# EasyEDA schematic 1-Schematic_54M-1_v1.0.2.json

## Sheets
1 Main: TITLE: Spectrum clone 54M-1; REV: 1.0.2; Date: 2022-12-22; Sheet: 1/2; Drawn By: Romych; Company: ZX-PK.RU
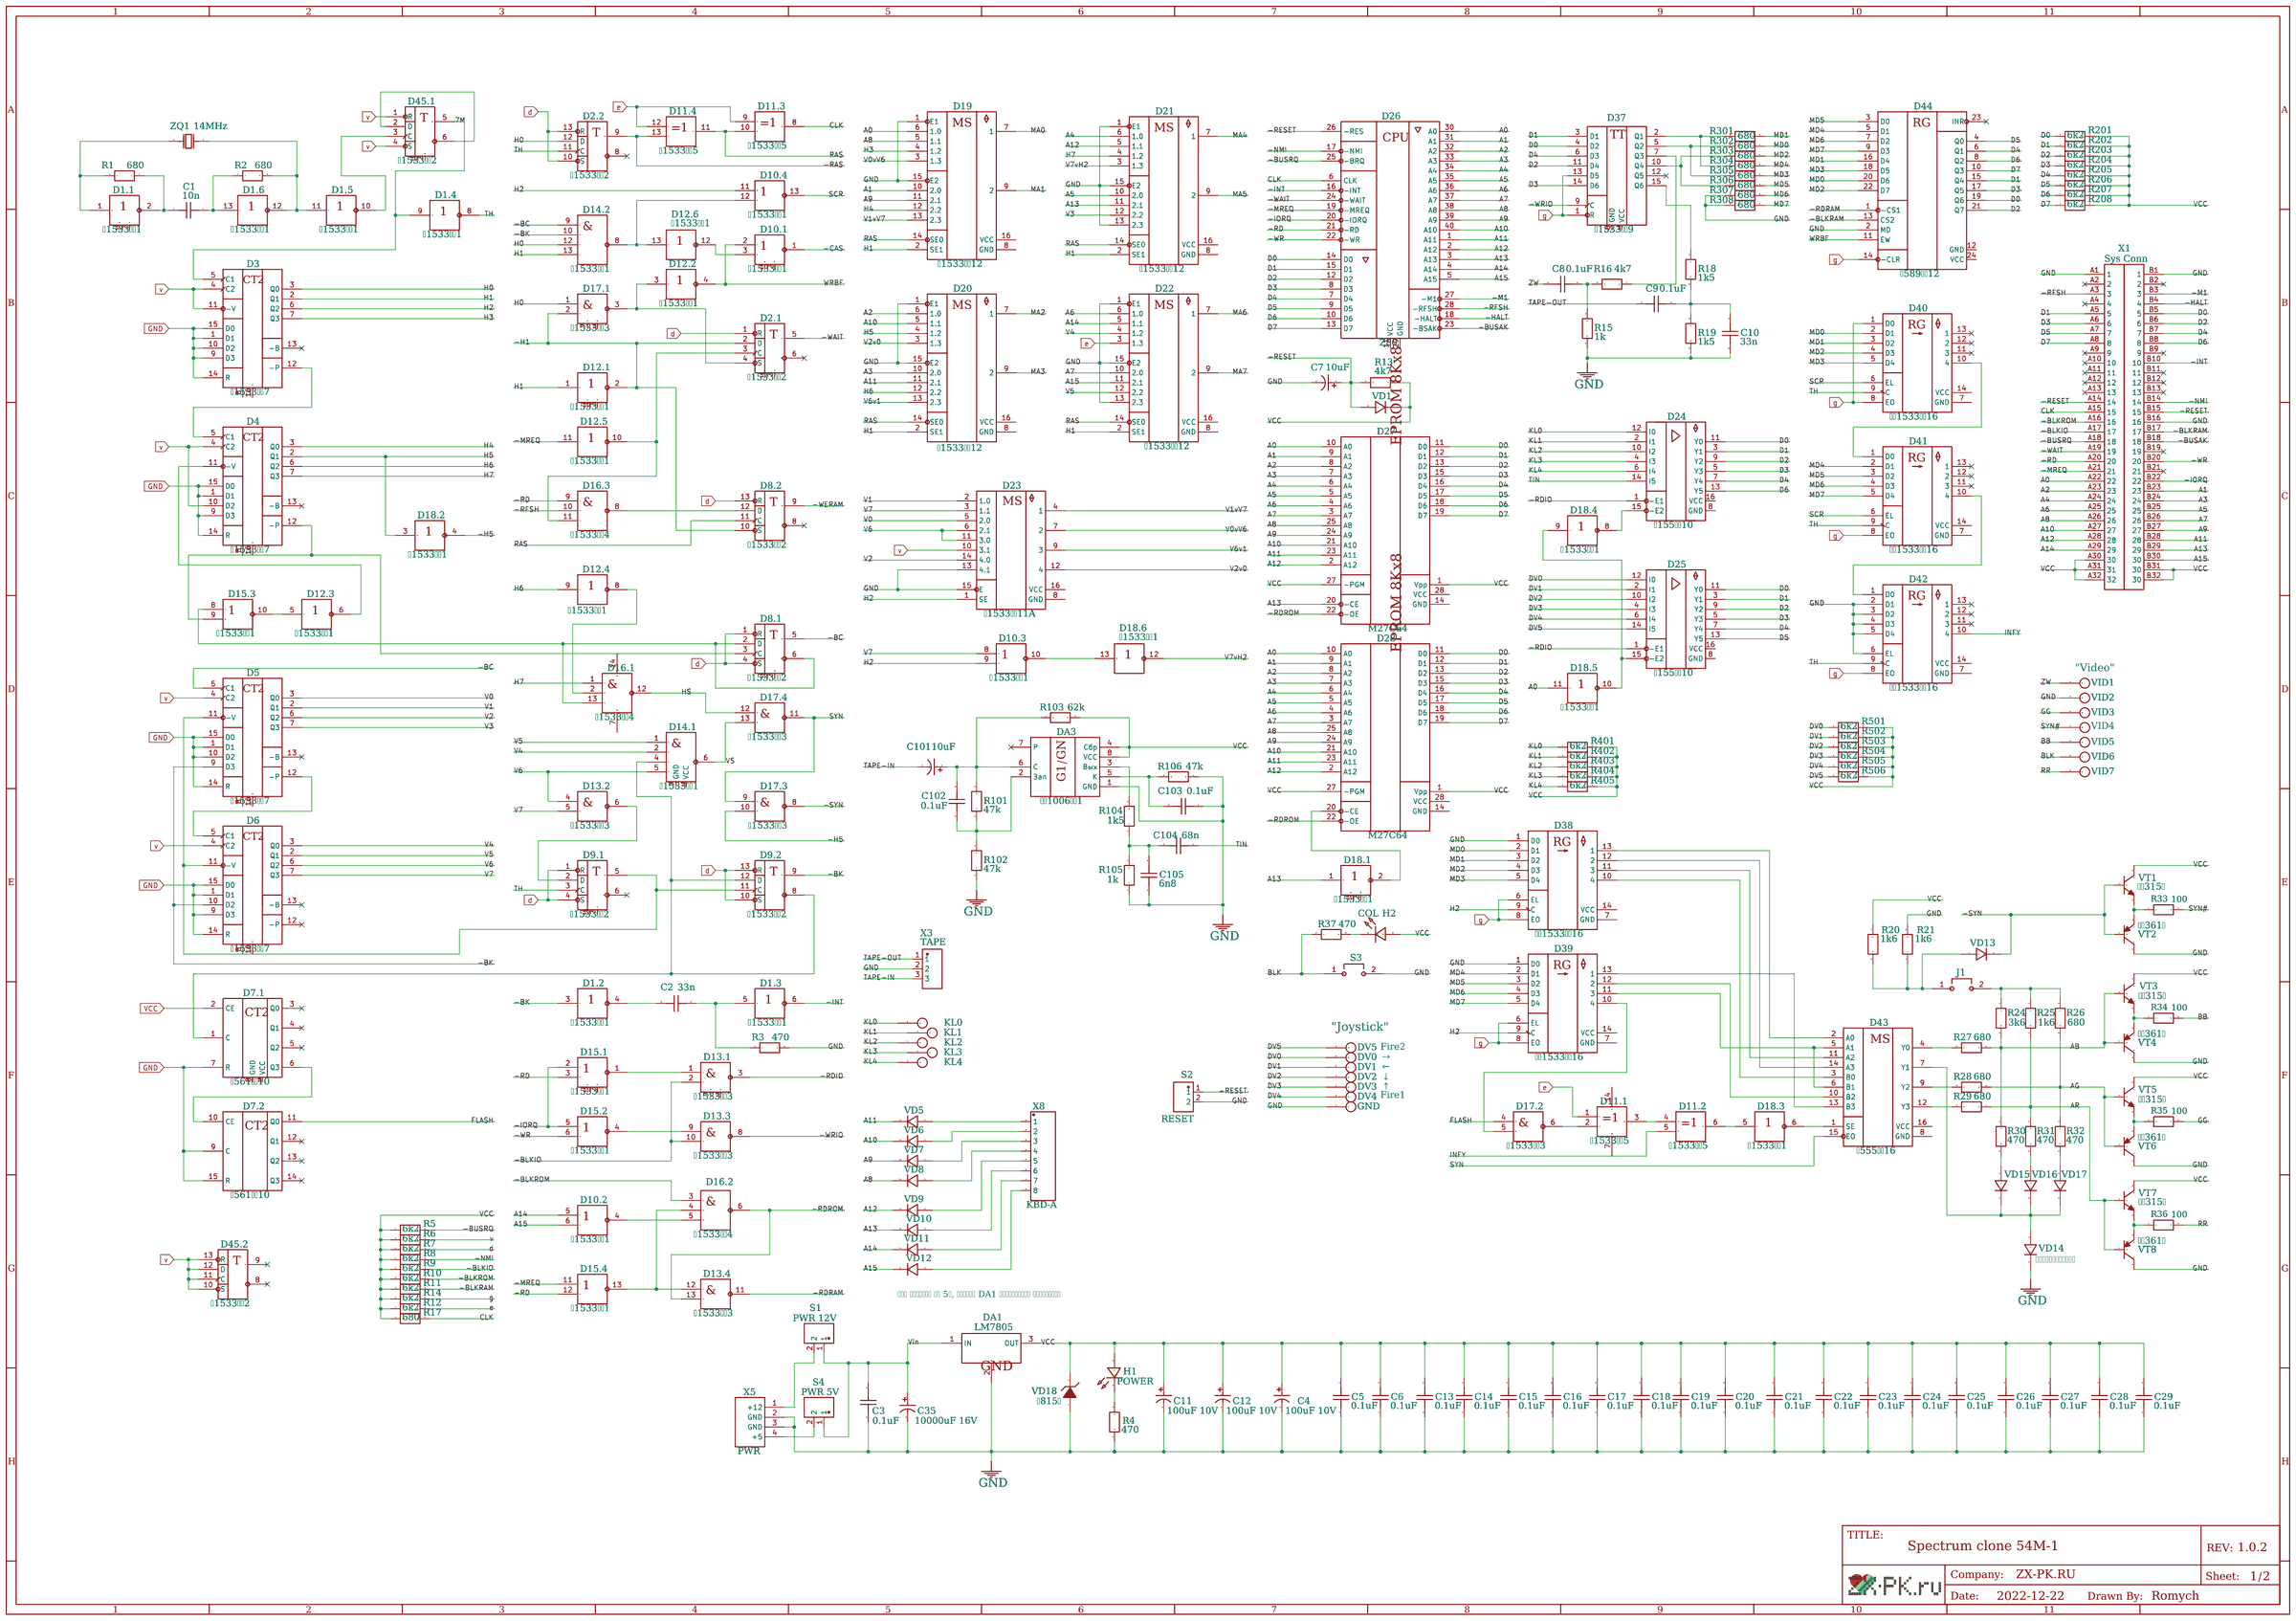
[diagram p0: Main]
2 DRAM: TITLE: Spectrum clone 54M-1 (DRAM); Sheet: 2/2
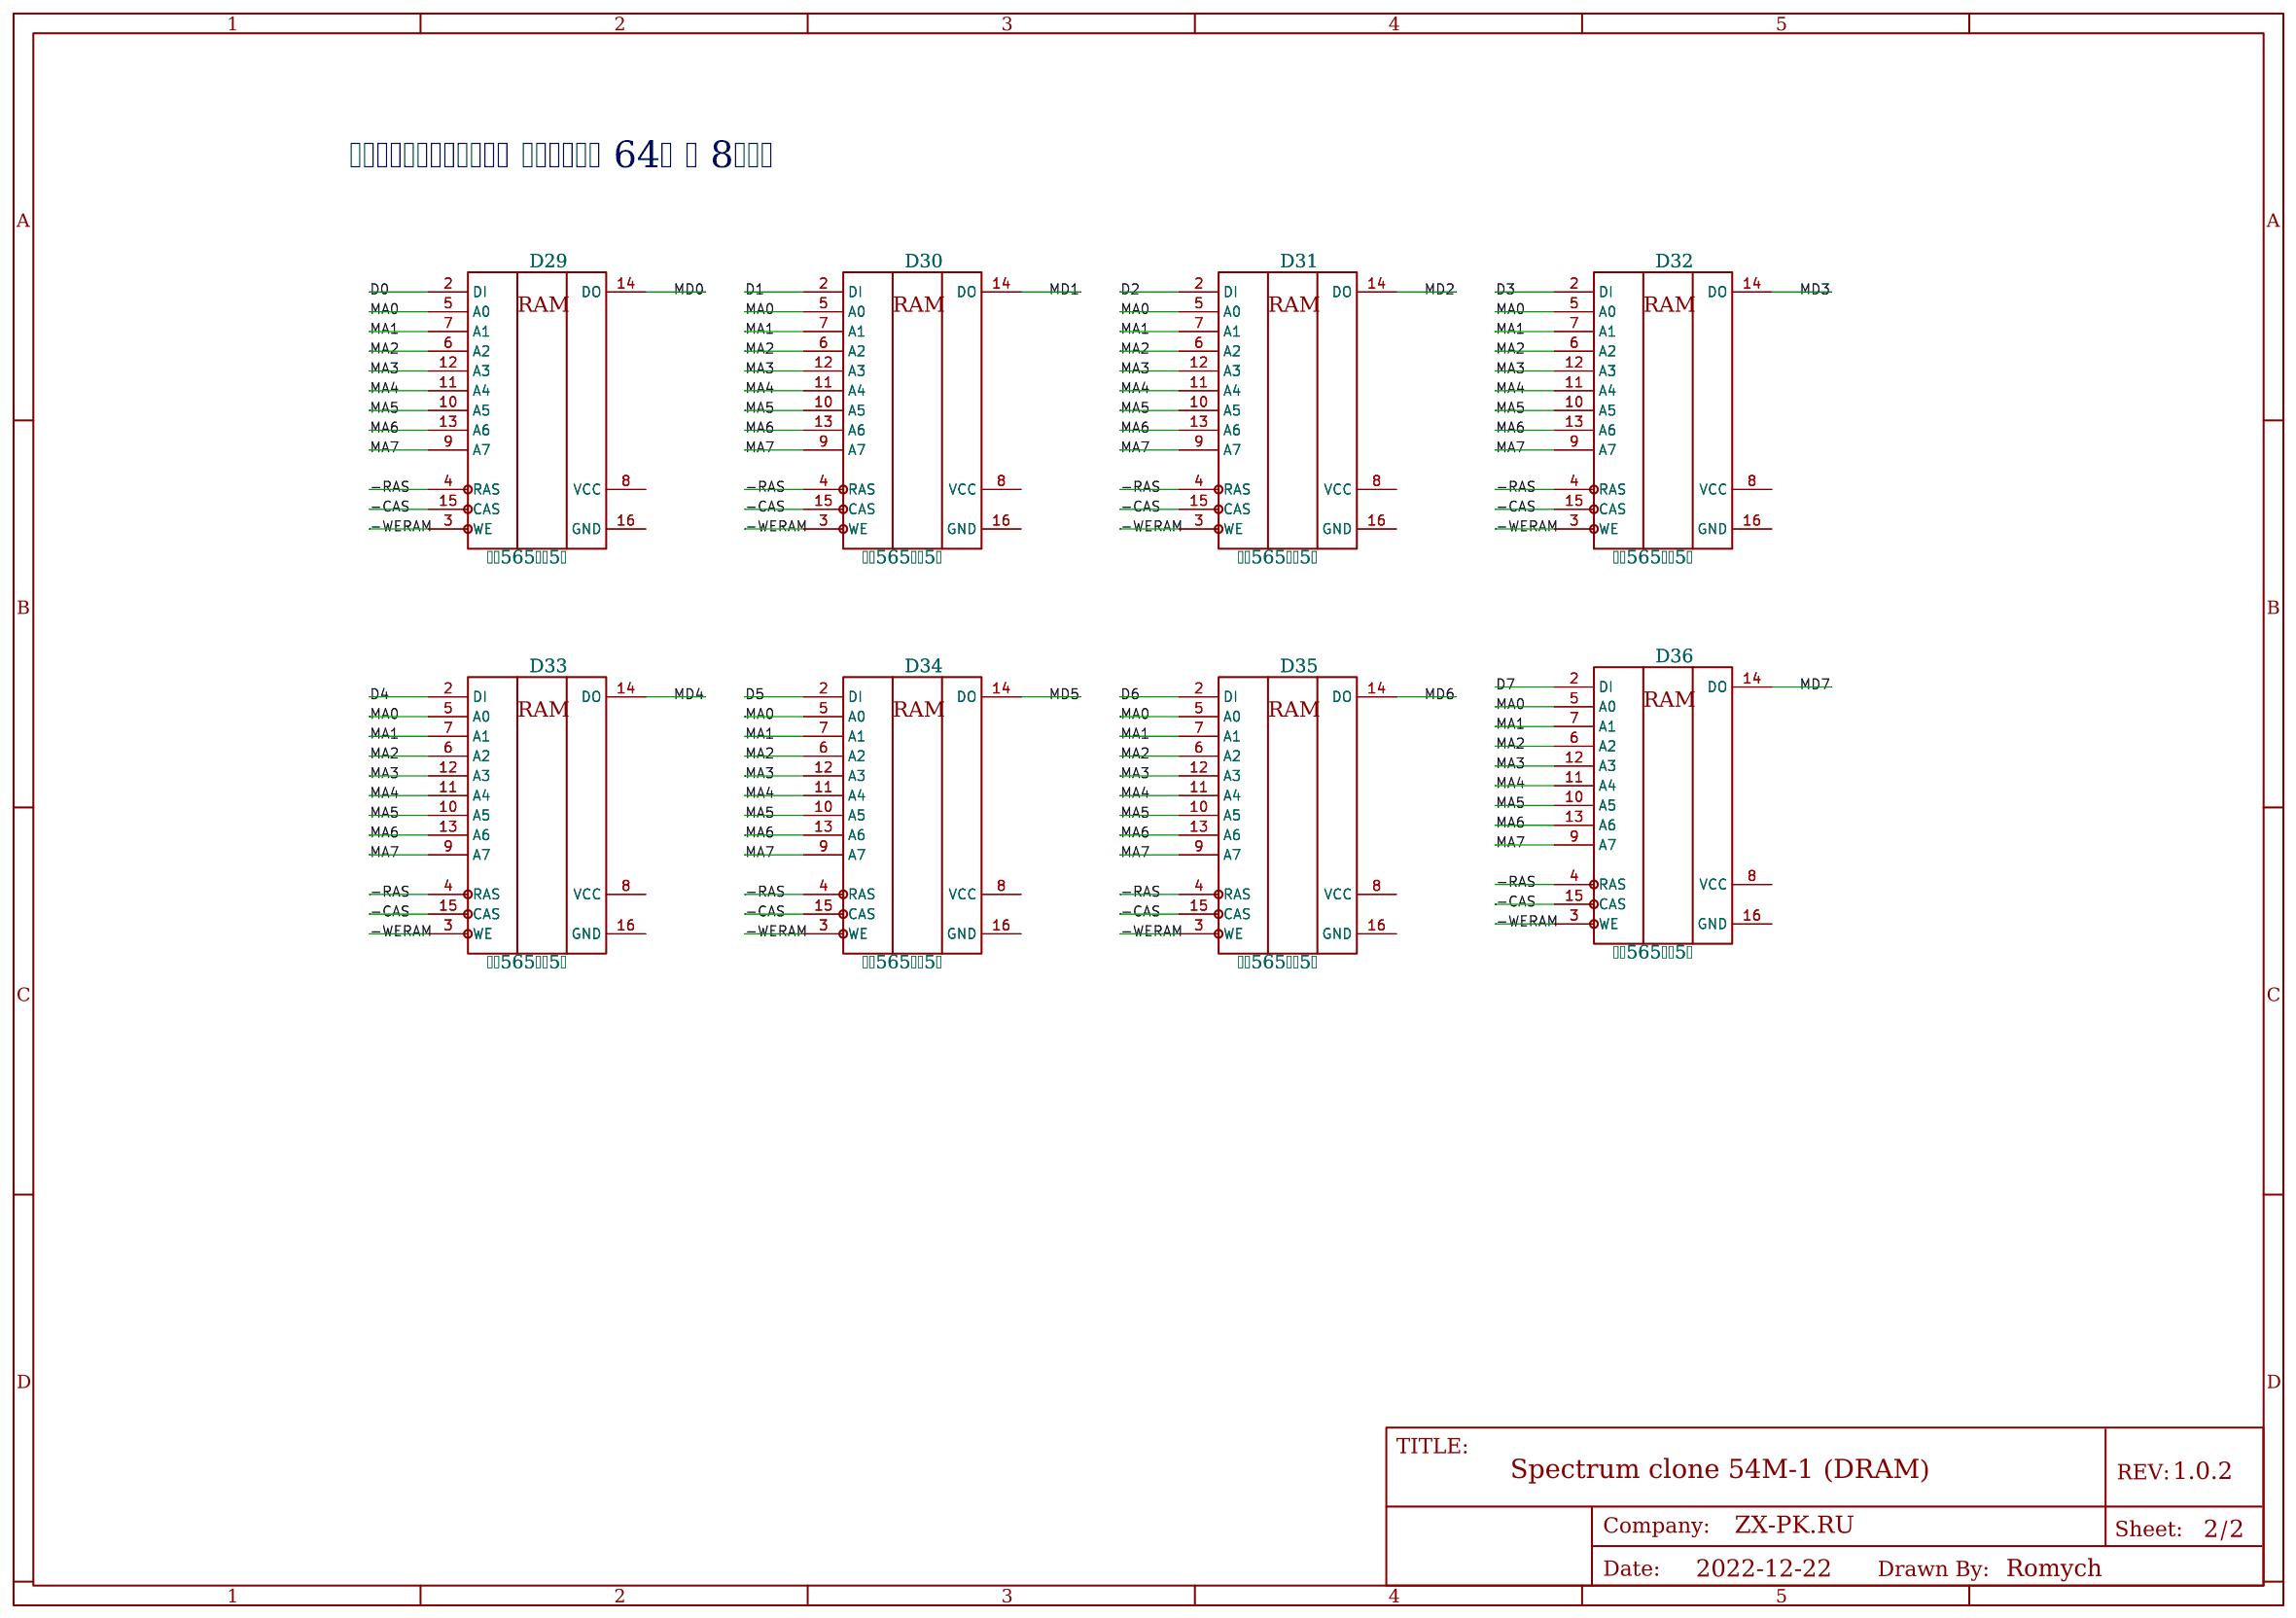
[diagram p1: DRAM]

## Parts
sheet DRAM
D29  КР565РУ5Г  [DIP-16_STD]
D30  КР565РУ5Г  [DIP-16_STD]
D31  КР565РУ5Г  [DIP-16_STD]
D32  КР565РУ5Г  [DIP-16_STD]
D33  КР565РУ5Г  [DIP-16_STD]
D34  КР565РУ5Г  [DIP-16_STD]
D35  КР565РУ5Г  [DIP-16_STD]
D36  КР565РУ5Г  [DIP-16_STD]
sheet Main
C1  10n  [CAP-TH_L5.08]
C2  33n  [CAP-TH_L5.08]
C3  0.1uF  [CAP-TH_L7.62]
C4  100uF 10V  [CAP-TH_L25_P7.62_EL_V]
C5  0.1uF  [CAP-TH_L7.62]
C6  0.1uF  [CAP-TH_L7.62]
C7  10uF  [CAP-TH_BD6.3-P2.50-D1.0-FD]
C8  0.1uF  [CAP-TH_L7.0-W3.0-P5.00-D0.9]
C9  0.1uF  [CAP-TH_L7.0-W3.0-P5.00-D0.9]
C10  33n  [CAP-TH_L7.0-W3.0-P5.00-D0.9]
C11  100uF 10V  [CAP-TH_L25_P7.62_EL_V]
C12  100uF 10V  [CAP-TH_L25_P7.62_EL_V]
C13  0.1uF  [CAP-TH_L7.62]
C14  0.1uF  [CAP-TH_L7.62]
C15  0.1uF  [CAP-TH_L7.62]
C16  0.1uF  [CAP-TH_L7.62]
C17  0.1uF  [CAP-TH_L7.62]
C18  0.1uF  [CAP-TH_L7.62]
C19  0.1uF  [CAP-TH_L7.62]
C20  0.1uF  [CAP-TH_L7.62]
C21  0.1uF  [CAP-TH_L7.62]
C22  0.1uF  [CAP-TH_L7.62]
C23  0.1uF  [CAP-TH_L7.62]
C24  0.1uF  [CAP-TH_L7.62]
C25  0.1uF  [CAP-TH_L7.62]
C26  0.1uF  [CAP-TH_L7.62]
C27  0.1uF  [CAP-TH_L7.62]
C28  0.1uF  [CAP-TH_L7.62]
C29  0.1uF  [CAP-TH_L7.62]
C35  10000uF 16V  [CAP-TH_L25_P7.62_EL_V]
C101  10uF  [CAP-TH_BD6.3-P2.50-D1.0-FD]
C102  0.1uF  [CAP-TH_L7.0-W3.0-P5.00-D0.9]
C103  0.1uF  [CAP-TH_L7.0-W3.0-P5.00-D0.9]
C104  68n  [CAP-TH_L7.0-W3.0-P5.00-D0.9]
C105  6n8  [CAP-TH_L7.0-W3.0-P5.00-D0.9]
D1  К1533ЛН1  [DIP-14_STD]  (sections 1,2,3,4,5,6)
D2  К1533ТМ2  [DIP-14_STD]  (sections 1,2)
D3  К1533ИЕ7  [DIP-16_STD]
D4  К1533ИЕ7  [DIP-16_STD]
D5  К1533ИЕ7  [DIP-16_STD]
D6  К1533ИЕ7  [DIP-16_STD]
D7  К561ИЕ10  [DIP-16_STD]  (sections 1,2)
D8  К1533ТМ2  [DIP-14_STD]  (sections 1,2)
D9  К1533ТМ2  [DIP-14_STD]  (sections 1,2)
D10  К1533ЛЕ1  [DIP-14_STD]  (sections 1,2,3,4)
D11  К1533ЛП5  [DIP-14_STD]  (sections 1,2,3,4)
D12  К1533ЛН1  [DIP-14_STD]  (sections 1,2,3,4,5,6)
D13  К1533ЛА3  [DIP-14_STD]  (sections 1,2,3,4)
D14  К1533ЛА1  [DIP-14_STD]  (sections 1,2)
D15  К1533ЛЕ1  [DIP-14_STD]  (sections 1,2,3,4)
D16  К1533ЛА4  [DIP-14_STD]  (sections 1,2,3)
D17  К1533ЛА3  [DIP-14_STD]  (sections 1,2,3,4)
D18  К1533ЛН1  [DIP-14_STD]  (sections 1,2,3,4,5,6)
D19  К1533КП12  [DIP-16_STD]
D20  К1533КП12  [DIP-16_STD]
D21  К1533КП12  [DIP-16_STD]
D22  К1533КП12  [DIP-16_STD]
D23  К1533КП11A  [DIP-16_STD]
D24  К155ЛП10  [DIP-16_STD]
D25  К155ЛП10  [DIP-16_STD]
D26  Z80  [DIP-40_STD]
D27  M27C64  [DIP-28_STD]
D28  M27C64  [DIP-28_STD]
D37  К1533ТМ9  [DIP-16_STD]
D38  КР1533ИР16  [DIP-14_STD]
D39  КР1533ИР16  [DIP-14_STD]
D40  КР1533ИР16  [DIP-14_STD]
D41  КР1533ИР16  [DIP-14_STD]
D42  КР1533ИР16  [DIP-14_STD]
D43  К555КП16  [DIP-16_STD]
D44  К589ИР12  [DIP-24_STD]
D45  К1533ТМ2  [DIP-14_STD]  (sections 1,2)
DA1  LM7805  [TO-220-3_L10.2-W4.5-P2.54-L]
DA3  КР1006ВИ1  [DIP-8_STD]
DV0  TH-TEST-1  [TH-TEST-1]
DV1  TH-TEST-1  [TH-TEST-1]
DV2  TH-TEST-1  [TH-TEST-1]
DV3  TH-TEST-1  [TH-TEST-1]
DV4  TH-TEST-1  [TH-TEST-1]
DV5  TH-TEST-1  [TH-TEST-1]
GND  TH-TEST-1  [TH-TEST-1]
H1  POWER  [D-TH_L2.54]
H2  COL  [D-TH_L2.54]
J1  Blank  [HDR-TH_2P_P2.54_SW]
KL0  KL0  [TH-TEST-1]
KL1  KL1  [TH-TEST-1]
KL2  KL2  [TH-TEST-1]
KL3  KL3  [TH-TEST-1]
KL4  KL4  [TH-TEST-1]
R1  680  [R_0.25_10.16]
R2  680  [R_0.25_10.16]
R3  470  [R_0.25_10.16]
R4  470  [R_0.125_7.62]
R5  6k2  [R_0.125_V_TH]
R6  6k2  [R_0.125_7.62]
R7  6k2  [R_0.125_7.62]
R8  6k2  [R_0.125_V_TH]
R9  6k2  [R_0.125_7.62]
R10  6k2  [R_0.125_7.62]
R11  6k2  [R_0.125_7.62]
R12  6k2  [R_0.125_7.62]
R13  4k7  [R_0.125_7.62]
R14  6k2  [R_0.125_7.62]
R15  1k  [R_0.125_7.62]
R16  4k7  [R_0.125_7.62]
R17  680  [R_0.125_7.62]
R18  1k5  [R_0.25_10.16]
R19  1k5  [R_0.25_10.16]
R20  1k6  [R_0.125_7.62]
R21  1k6  [R_0.125_7.62]
R24  3k6  [R_0.125_7.62]
R25  1k6  [R_0.125_7.62]
R26  680  [R_0.125_7.62]
R27  680  [R_0.25_10.16]
R28  680  [R_0.25_10.16]
R29  680  [R_0.25_10.16]
R30  470  [R_0.125_V_TH]
R31  470  [R_0.125_V_TH]
R32  470  [R_0.125_V_TH]
R33  100  [R_0.125_7.62]
R34  100  [R_0.125_7.62]
R35  100  [R_0.125_7.62]
R36  100  [R_0.125_7.62]
R37  470  [R_0.125_7.62]
R101  47k  [R_0.25_10.16]
R102  47k  [R_0.25_10.16]
R103  62k  [R_0.25_10.16]
R104  1k5  [R_0.25_10.16]
R105  1k  [R_0.25_10.16]
R106  47k  [R_0.25_10.16]
R201  6k2  [R_0.125_V_TH]
R202  6k2  [R_0.125_V_TH]
R203  6k2  [R_0.125_7.62]
R204  6k2  [R_0.125_V_TH]
R205  6k2  [R_0.125_V_TH]
R206  6k2  [R_0.125_V_TH]
R207  6k2  [R_0.125_V_TH]
R208  6k2  [R_0.125_V_TH]
R301  680  [R_0.25_10.16]
R302  680  [R_0.25_10.16]
R303  680  [R_0.25_10.16]
R304  680  [R_0.25_10.16]
R305  680  [R_0.25_10.16]
R306  680  [R_0.25_10.16]
R307  680  [R_0.25_10.16]
R308  680  [R_0.25_10.16]
R401  6k2  [R_0.125_V_TH]
R402  6k2  [R_0.125_V_TH]
R403  6k2  [R_0.125_V_TH]
R404  6k2  [R_0.125_V_TH]
R405  6k2  [R_0.125_V_TH]
R501  6k2  [R_0.125_V_TH]
R502  6k2  [R_0.125_V_TH]
R503  6k2  [R_0.125_V_TH]
R504  6k2  [R_0.125_V_TH]
R505  6k2  [R_0.125_V_TH]
R506  6k2  [R_0.125_V_TH]
S1  PWR 12V  [HDR-TH_2P-P2.54-M]
S2  RESET  [HDR-TH_2P-P2.54-M]
S3  BLK  [HDR-TH_2P_P2.54_SW]
S4  PWR 5V  [HDR-TH_2P-P2.54-M]
SYN  SYN  [TH-TEST-1]
VD1  1N4148  [D_TH_7.62]
VD5  1N4148  [SOD123]
VD6  1N4148  [SOD123]
VD7  1N4148  [SOD123]
VD8  1N4148  [SOD123]
VD9  1N4148  [SOD123]
VD10  1N4148  [SOD123]
VD11  1N4148  [SOD123]
VD12  1N4148  [SOD123]
VD13  1N4148  [D_TH_7.62]
VD14  1N4148  [DIODE-TH_10.16]
VD15  1N4148  [DIODE-TH_L2.54]
VD16  1N4148  [DIODE-TH_L2.54]
VD17  1N4148  [DIODE-TH_L2.54]
VD18  Д815А  [D_TH_7.62]
VID1  ZW  [TH-TEST-1]
VID2  GND  [TH-TEST-1]
VID3  G  [TH-TEST-1]
VID5  B  [TH-TEST-1]
VID6  BLK  [TH-TEST-1]
VID7  R  [TH-TEST-1]
VT1  КТ315Б  [KT315_STD]
VT2  КТ361Б  [KT315_STD]
VT3  КТ315Б  [KT315_STD]
VT4  КТ361Б  [KT315_STD]
VT5  КТ315Б  [KT315_STD]
VT6  КТ361Б  [KT315_STD]
VT7  КТ315Б  [KT315_STD]
VT8  КТ361Б  [KT315_STD]
X1  Sys Conn  [HDR-TH_64P_P2.54_R2]
X3  TAPE  [HDR-TH_3P-P2.54-V-F]
X5  PWR  [CONN-TH-4P-JVC_MINI]
X8  KBD-A  [HDR-TH_8P-P2.54-V-M]
ZQ1  14MHz  [OSC-49U-1]

## Library data of the parts
D29-D36 = КР565РУ5Г: Supplier: chipdip; Contributor: romychs_4693
C1 C2 C8-C10 C102-C105 = CK45-R3AD152K-VRY: Supplier: LCSC; Supplier Part: C340608; Manufacturer: TDK; Contributor: LCSC
C3 C5 C6 C13-C29 = CK45-R3AD152K-VRY: Supplier: LCSC; Supplier Part: C340608; Manufacturer: TDK; Contributor: LCSC; JLCPCB Part Class: Extended Part
C4 C7 C11 C12 C35 C101 = ECLJ0612220M101P00: Supplier: LCSC; Supplier Part: C156809; Manufacturer: Guangdong TOPAZ Elec Tech; Contributor: LCSC
D1 D12 = К1533ЛН1: Supplier: chipdip; Contributor: Roman Boykov; subpart_no: 7
D2 D8 = К1533ТМ2: Supplier: chipdip; Contributor: romychs_4693; subpart_no: 4
D3-D6 = К1533ИЕ7: Contributor: romychs_4693
D7 = К561ИЕ10: Supplier: chipdip; Contributor: romychs_4693; subpart_no: 1
D9 D45 = К1533ТМ2: Supplier: chipdip; Contributor: romychs_4693; subpart_no: 3
D10 = К1533ЛЕ1: Supplier: chipdip; Contributor: Roman Boykov; subpart_no: 4
D11 = К1533ЛП5: Supplier: chipdip; Contributor: Roman Boykov; subpart_no: 4
D13 = К1533ЛА3: Supplier: chipdip; Contributor: Roman Boykov; subpart_no: 2
D14 = К1533ЛА1: Supplier: chipdip; Contributor: romychs_4693; subpart_no: 1
D15 = К1533ЛЕ1: Supplier: chipdip; Contributor: Roman Boykov; subpart_no: 3
D16 = К1533ЛА4: Supplier: chipdip; Contributor: Roman Boykov; subpart_no: 1
D17 = К1533ЛА3: Supplier: chipdip; Contributor: Roman Boykov; subpart_no: 1
D18 = К1533ЛН1: Supplier: chipdip; Contributor: Roman Boykov; subpart_no: 12
D19-D22 = К1533КП12: Supplier: chipdip; Contributor: romychs_4693
D23 = К1533КП11A: Supplier: chipdip; Contributor: Roman Boykov
D24 D25 = К155ЛП10: Supplier: chipdip; Contributor: romychs_4693
D26 = Z80B: Manufacturer: Zilog; Contributor: romychs_4693
D27 D28 = M27C64: Manufacturer: Microchip; Manufacturer Part: 27C64; Supplier: chipdip; Contributor: Roman Boykov
D37 = К1533ТМ9: Supplier: chipdip; Contributor: Roman Boykov
D38-D42 = КР1533ИР16: Supplier: chipdip; Contributor: romychs_4693
D43 = К555КП16: Supplier: chipdip; Contributor: Roman Boykov
D44 = К589ИР12: Supplier: chipdip; Contributor: Roman Boykov
DA1 = LM7805CTG: Supplier: LCSC; Supplier Part: C2977083; Manufacturer: HGC(深圳汉芯); link: https://atta.szlcsc.com/upload/public/pdf/source/20220425/1AD29514C6CC449CC18E73451741492B.pdf; Contributor: lcsc; JLCPCB Part Class: Extended Part
DA3 = КР1006ВИ1: Supplier: chipdip; Contributor: romychs_4693
DV0-DV5 GND KL0-KL4 SYN VID1-VID3 VID5-VID7 = TH-TEST-1: Contributor: romychs_4693
H1 H2 = LED-0603_R: Manufacturer: EVERLIGHT(台湾亿光); Manufacturer Part: 19-217/R6C-AL1M2VY/3T; Supplier Part: C72044; Supplier: LCSC; Contributor: LCEDA_01
J1 S3 = Jumper-2PM: Contributor: Roman Boykov
R1-R21 R24-R37 R101-R106 R201-R208 R301-R308 R401-R405 R501-R506 = RN 1/8W 470R F T/B A1: Supplier: LCSC; Supplier Part: C433478; Manufacturer: TyoHM; Contributor: LCSC
S1 S2 S4 = X6511FV-02-C85D32: Supplier: LCSC; Supplier Part: C718243; Manufacturer: XKB Connectivity; Contributor: LCSC; JLCPCB Part Class: Extended Part
VD1 VD5-VD17 = 1N4148: Contributor: EasyEDA
VD18 = 1N4742A: Supplier: LCSC; Manufacturer: Tak Cheong; Supplier Part: C113210; JLCPCB Part Class: Extended Part
VT1 VT3 VT5 VT7 = КТ315Б: Supplier: LCSC; Manufacturer: Russia; Manufacturer Part: КТ315; Supplier Part: КТ315; JLCPCB Part Class: Extended Part
VT2 VT4 VT6 VT8 = КТ361Б: Supplier Part: КТ361; Manufacturer: Changjiang Electronics Tech (CJ); Manufacturer Part: Russia; Contributor: LCSC; JLCPCB Part Class: Extended Part
X1 = PinHeader_2x32: Contributor: Roman Boykov
X3 = 22025403P00CKMT: Supplier: LCSC; Manufacturer: Ckmtw; Contributor: LCSC; Supplier Part: C146690; JLCPCB Part Class: Extended Part
X5 = JVC Mini-4P: Contributor: romychs_4693
X8 = Header-Male-2.54_1x8: Supplier: LCSC; Manufacturer: Ckmtw; Manufacturer Part: 210S-1*8P L=11.6MMGold-plated black; Contributor: LCSC; Supplier Part: C124381
ZQ1 = X49UD12MSD2SC: Supplier: LCSC; Manufacturer: YXC; Supplier Part: C2188

## Nets
DV0: D25.12(I0) DV0.1(TP1) R501.1
DV1: D25.2(I1) DV1.1(TP1) R502.1
DV2: D25.10(I2) DV2.1(TP1) R503.1
DV3: D25.4(I3) DV3.1(TP1) R504.1
DV4: D25.6(I4) DV4.1(TP1) R505.1
DV5: D25.14(I5) DV5.1(TP1) R506.1
GND: C3.1 C4.2 C5.1 C6.1 C7.2 C10.2 C11.2 C12.2 C13.1 C14.1 C15.1 C16.1 C17.1 C18.1 C19.1 C20.1 C21.1 C22.1 C23.1 C24.1 C25.1 C26.1 C27.1 C28.1 C29.1 C35.2 C103.1 C105.1 D3.1(D1) D3.9(D3) D3.10(D2) D3.14(R) D3.15(D0) D4.1(D1) D4.9(D3) D4.14(R) D4.15(D0) D5.1(D1) D5.10(D2) D5.14(R) D5.15(D0) D6.1(D1) D6.9(D3) D6.14(R) D6.15(D0) D7.7(R) D7.9(C) D7.15(R) D19.1(E1) D19.15(E2) D20.1(E1) D20.15(E2) D21.1(E1) D21.13(2.3) D21.15(E2) D22.1(E1) D22.13(2.3) D22.15(E2) D23.13(4.1) D23.15(E) D38.1(D0) D39.1(D0) D42.2(D1) D42.3(D2) D42.4(D3) D42.5(D4) D42.6(EL) D44.2(MD) DA1.2(GND) DA3.1(GND) GND.1(TP1) R3.2 R4.1 R15.2 R19.2 R21.2 R102.1 R105.1 R106.1 R307.2 R308.2 S2.2 S3.2 VD14.2(K) VD18.1(A) VID2.1(TP1) VT2.2(C) VT4.2(C) VT6.2(C) VT8.2(C) X1.A1(1) X1.B1(1) X1.B16(16) X3.2 X5.2(GND) X5.3(GND)
V0: D5.3(Q0) D23.5(2.0)
V0vV6: D19.3(1.3) D23.7(2)
V1: D5.2(Q1) D23.2(1.0)
V1vV7: D19.13(2.3) D23.4(1)
V2: D5.6(Q2) D23.14(4.0)
V2v0: D20.3(1.3) D23.12(4)
V3: D5.7(Q3) D21.12(2.2)
V4: D6.3(Q0) D14.2 D22.4(1.2)
V5: D6.2(Q1) D14.1 D22.12(2.2)
V6: D6.6(Q2) D13.4(1) D14.5(4) D23.6(2.1) D23.11(3.0)
V6v1: D20.13(2.3) D23.9(3)
V7: D6.7(Q3) D10.8(1) D13.5(2) D23.3(1.1)
V7vH2: D18.12(2) D21.3(1.3)
VCC: C4.1 C5.2 C6.2 C11.1 C12.1 C13.2 C14.2 C15.2 C16.2 C17.2 C18.2 C19.2 C20.2 C21.2 C22.2 C23.2 C24.2 C25.2 C26.2 C27.2 C28.2 C29.2 D7.2(CE) D27.1(Vpp) D27.27(-PGM) D28.1(Vpp) D28.27(-PGM) DA1.3(OUT) DA3.4(Сбр) DA3.8(VCC) H1.1 H2.1 R5.1 R6.1 R7.1 R8.1 R9.1 R10.1 R11.1 R12.1 R13.1 R14.1 R17.1 R20.1 R103.2 R201.2 R202.2 R203.2 R204.2 R205.2 R206.2 R207.2 R208.2 R401.2 R402.2 R403.2 R404.2 R405.2 R501.2 R502.2 R503.2 R504.2 R505.2 R506.2 VD1.2(K) VD18.2(K) VT1.2(C) VT3.2(C) VT5.2(C) VT7.2(C) X1.A30(30) X1.A31(31) X1.A32(32) X1.B31(30) X1.B32(30)
Vin: C3.2 C35.1 DA1.1(IN) S1.1 S4.1
7M: D1.9(1) D3.5(C1) D45.5(Q)
-BC: D5.5(C1) D8.5(Q) D14.9(1)
-BK: D1.3(1) D5.9(D3) D6.10(D2) D9.9(Q) D14.10(2)
-BLKIO: D13.2 D13.10(2) R9.2 X1.A17(17)
-BLKRAM: D44.13(CS2) R11.2 X1.B17(17)
-BLKROM: D16.3(I1) R10.2 X1.A16(16)
-BUSAK: D26.23(-BSAK) X1.B18(18)
-BUSRQ: D26.25(-BRQ) R5.2 X1.A18(18)
-CAS: D10.1(3) D29.15(CAS) D30.15(CAS) D31.15(CAS) D32.15(CAS) D33.15(CAS) D34.15(CAS) D35.15(CAS) D36.15(CAS)
-H1: D2.2(D) D8.10(S) D12.2 D17.2
-H5: D17.10(2) D18.4(2)
-HALT: D26.18(-HALT) X1.B4(4)
-INT: D1.6(2) D26.16(-INT) X1.B10(10)
-IORQ: D15.2(1) D15.5(1) D26.20(-IORQ) X1.B22(22)
-M1: D26.27(-M1) X1.B3(3)
-MREQ: D12.11(1) D15.11(1) D26.19(-MREQ) X1.A21(21)
-NMI: D26.17(-NMI) R8.2 X1.B14(14)
-RAS: D2.9(Q) D11.13(2) D29.4(RAS) D30.4(RAS) D31.4(RAS) D32.4(RAS) D33.4(RAS) D34.4(RAS) D35.4(RAS) D36.4(RAS)
-RD: D15.3(2) D15.12(2) D16.9(I1) D26.21(-RD) X1.A20(20)
-RDIO: D13.3 D24.1(-E1) D25.1(-E1)
-RDRAM: D13.11(3) D44.1(-CS1)
-RDROM: D13.13(2) D16.6(O) D27.22(-OE) D28.22(-OE)
-RESET: C7.1 D26.26(-RES) R13.2 S2.1 VD1.1(A) X1.A14(14) X1.B15(15)
-RFSH: D16.10(I2) D26.28(-RFSH) X1.A3(3)
-SYN: D17.8(3) VD13.2(K) VT1.1(B) VT2.1(B)
-WAIT: D2.5(Q) D26.24(-WAIT) X1.A19(19)
-WERAM: D8.9(Q) D29.3(WE) D30.3(WE) D31.3(WE) D32.3(WE) D33.3(WE) D34.3(WE) D35.3(WE) D36.3(WE)
-WR: D15.6(2) D26.22(-WR) X1.B20(20)
-WRIO: D13.8(3) D37.9(C)
A0: D18.11(1) D19.6(1.0) D26.30(A0) D27.10(A0) D28.10(A0) X1.A22(22)
A1: D19.10(2.0) D26.31(A1) D27.9(A1) D28.9(A1) X1.B23(23)
A2: D20.6(1.0) D26.32(A2) D27.8(A2) D28.8(A2) X1.A23(23)
A3: D20.10(2.0) D26.33(A3) D27.7(A3) D28.7(A3) X1.B24(24)
A4: D21.6(1.0) D26.34(A4) D27.6(A4) D28.6(A4) X1.A24(24)
A5: D21.10(2.0) D26.35(A5) D27.5(A5) D28.5(A5) X1.B25(25)
A6: D22.6(1.0) D26.36(A6) D27.4(A6) D28.4(A6) X1.A25(25)
A7: D22.10(2.0) D26.37(A7) D27.3(A7) D28.3(A7) X1.B26(26)
A8: D19.5(1.1) D26.38(A8) D27.25(A8) D28.25(A8) VD8.2(K) X1.A26(26)
A9: D19.11(2.1) D26.39(A9) D27.24(A9) D28.24(A9) VD7.2(K) X1.B27(27)
A10: D20.5(1.1) D26.40(A10) D27.21(A10) D28.21(A10) VD6.2(K) X1.A27(27)
A11: D20.11(2.1) D26.1(A11) D27.23(A11) D28.23(A11) VD5.2(K) X1.B28(28)
A12: D21.5(1.1) D26.2(A12) D27.2(A12) D28.2(A12) VD9.2(K) X1.A28(28)
A13: D18.1 D21.11(2.1) D26.3(A13) D27.20(-CE) VD10.2(K) X1.B29(29)
A14: D10.5(1) D22.5(1.1) D26.4(A14) VD11.2(K) X1.A29(29)
A15: D10.6(2) D22.11(2.1) D26.5(A15) VD12.2(K) X1.B30(30)
AB: R24.2 R27.1 R30.1 VT3.1(B) VT4.1(B)
AG: R26.2 R28.1 R32.1 VT5.1(B) VT6.1(B)
AR: R25.2 R29.1 R31.1 VT7.1(B) VT8.1(B)
BB: R34.2 VID5.1(TP1)
BLK: R37.1 S3.1 VID6.1(TP1)
CLK: D11.8(3) D26.6(CLK) R17.2 X1.A15(15)
d: D2.1(R) D2.10(S) D2.13(R) D8.1(R) D8.4(S) D8.13(R) D9.1(R) D9.4(S) D9.10(S) D9.13(R) R7.2
D0: D24.11(Y0) D25.11(Y0) D26.14(D0) D27.11(D0) D28.11(D0) D29.2(DI) D37.4(D2) D44.19(Q6) R201.1 X1.B5(5)
D1: D24.3(Y1) D25.3(Y1) D26.15(D1) D27.12(D1) D28.12(D1) D30.2(DI) D37.3(D1) D44.15(Q4) R202.1 X1.A5(5)
D2: D24.9(Y2) D25.9(Y2) D26.12(D2) D27.13(D2) D28.13(D2) D31.2(DI) D37.11(D4) D44.21(Q7) R203.1 X1.B6(6)
D3: D24.5(Y3) D25.5(Y3) D26.8(D3) D27.15(D3) D28.15(D3) D32.2(DI) D37.14(D6) D44.17(Q5) R204.1 X1.A6(6)
D4: D24.7(Y4) D25.7(Y4) D26.7(D4) D27.16(D4) D28.16(D4) D33.2(DI) D37.6(D3) D44.6(Q1) R205.1 X1.B7(7)
D5: D25.13(Y5) D26.9(D5) D27.17(D5) D28.17(D5) D34.2(DI) D44.4(Q0) R206.1 X1.A7(7)
D6: D24.13(Y5) D26.10(D6) D27.18(D6) D28.18(D6) D35.2(DI) D44.8(Q2) R207.1 X1.B8(8)
D7: D26.13(D7) D27.19(D7) D28.19(D7) D36.2(DI) D44.10(Q3) R208.1 X1.A8(8)
e: D11.1 D11.9(1) D11.12(1) D22.3(1.3) R12.2
FLASH: D7.11(Q0) D17.4(1)
g: D37.1(R) D37.13(D5) D38.6(EL) D38.8(EO) D39.6(EL) D39.8(EO) D40.1(D0) D40.8(EO) D41.8(EO) D42.8(EO) D44.14(-CLR) R14.2
GG: R35.2 VID3.1(TP1)
H0: D2.12(D) D3.3(Q0) D14.12(3) D17.1
H1: D3.2(Q1) D12.1 D14.13(4) D19.2(SE1) D20.2(SE1) D21.2(SE1) D22.2(SE1)
H2: D3.6(Q2) D10.9(2) D10.11(1) D23.1(SE) D38.9(C) D39.9(C)
H3: D3.7(Q3) D19.4(1.2)
H4: D4.3(Q0) D19.12(2.2)
H5: D4.2(Q1) D18.3(1) D20.4(1.2)
H6: D4.6(Q2) D12.9(1) D20.12(2.2)
H7: D4.7(Q3) D16.1(I1) D21.4(1.2)
HS: D16.12(O) D17.12(1)
INFY: D11.5(2) D42.10(4)
KL0: D24.12(I0) KL0.1(TP1) R401.1
KL1: D24.2(I1) KL1.1(TP1) R402.1
KL2: D24.10(I2) KL2.1(TP1) R403.1
KL3: D24.4(I3) KL3.1(TP1) R404.1
KL4: D24.6(I4) KL4.1(TP1) R405.1
MA0: D19.7(1) D29.5(A0) D30.5(A0) D31.5(A0) D32.5(A0) D33.5(A0) D34.5(A0) D35.5(A0) D36.5(A0)
MA1: D19.9(2) D29.7(A1) D30.7(A1) D31.7(A1) D32.7(A1) D33.7(A1) D34.7(A1) D35.7(A1) D36.7(A1)
MA2: D20.7(1) D29.6(A2) D30.6(A2) D31.6(A2) D32.6(A2) D33.6(A2) D34.6(A2) D35.6(A2) D36.6(A2)
MA3: D20.9(2) D29.12(A3) D30.12(A3) D31.12(A3) D32.12(A3) D33.12(A3) D34.12(A3) D35.12(A3) D36.12(A3)
MA4: D21.7(1) D29.11(A4) D30.11(A4) D31.11(A4) D32.11(A4) D33.11(A4) D34.11(A4) D35.11(A4) D36.11(A4)
MA5: D21.9(2) D29.10(A5) D30.10(A5) D31.10(A5) D32.10(A5) D33.10(A5) D34.10(A5) D35.10(A5) D36.10(A5)
MA6: D22.7(1) D29.13(A6) D30.13(A6) D31.13(A6) D32.13(A6) D33.13(A6) D34.13(A6) D35.13(A6) D36.13(A6)
MA7: D22.9(2) D29.9(A7) D30.9(A7) D31.9(A7) D32.9(A7) D33.9(A7) D34.9(A7) D35.9(A7) D36.9(A7)
MD0: D29.14(DO) D38.2(D1) D40.2(D1) D44.20(D6) R302.1
MD1: D30.14(DO) D38.3(D2) D40.3(D2) D44.16(D4) R301.1
MD2: D31.14(DO) D38.4(D3) D40.4(D3) D44.22(D7) R303.1
MD3: D32.14(DO) D38.5(D4) D40.5(D4) D44.18(D5) R305.1
MD4: D33.14(DO) D39.2(D1) D41.2(D1) D44.5(D1) R304.1
MD5: D34.14(DO) D39.3(D2) D41.3(D2) D44.3(D0) R306.1
MD6: D35.14(DO) D39.4(D3) D41.4(D3) D44.7(D2) R307.1
MD7: D36.14(DO) D39.5(D4) D41.5(D4) D44.9(D3) R308.1
RAS: D8.11(C) D11.10(2) D11.11(3) D19.14(SE0) D20.14(SE0) D21.14(SE0) D22.14(SE0)
RR: R36.2 VID7.1(TP1)
SCR: D10.13(3) D40.6(EL) D41.6(EL)
SYN: D17.9(1) D17.11(3) D43.15(EO)
SYN#: R33.2 SYN.1(TP1)
TAPE-IN: C101.2 X3.3
TAPE-OUT: C9.2 X3.1
TH: D1.8(2) D2.11(C) D9.3(С) D40.9(C) D41.9(C) D42.9(C)
TIN: C104.1 D24.14(I5)
v: D3.4(C2) D3.11(-V) D4.4(C2) D4.10(D2) D5.4(C2) D6.4(C2) D23.10(3.1) D45.1(R) D45.4(S) D45.10(S) D45.11(C) D45.12(D) D45.13(R) R6.2
VS: D14.6(5) D17.13(2)
WRBF: D10.2(1) D12.4(2) D44.11(EW)
ZW: C8.2 VID1.1(TP1)
Net-(C1-1): C1.1 D1.13(1) R2.1
Net-(C1-2): C1.2 D1.2 R1.2
Net-(C2-1): C2.1 D1.5(1) R3.1
Net-(C2-2): C2.2 D1.4(2)
Net-(C8-1): C8.1 R15.1 R16.2
Net-(C9-1): C9.1 C10.1 R18.2 R19.1
Net-(C101-1): C101.1 C102.2 DA3.6(C) R101.2 R103.1
Net-(C102-1): C102.1 DA3.2(Зап) R101.1 R102.2
Net-(C103-2): C103.2 DA3.5(K) R106.2
Net-(C104-2): C104.2 C105.2 R104.1 R105.2
Net-(D1.1-1): D1.1 R1.1 ZQ1.2(OSC2)
Net-(D1.5-10): D1.10(2) D45.3(С)
Net-(D1.5-11): D1.11(1) D1.12(2) R2.2 ZQ1.1(OSC1)
Net-(D2.1-3): D2.3(С) D12.10(2) D16.11(I3)
Net-(D2.1-4): D2.4(S) D12.3(1) D17.3
Net-(D3-12): D3.12(-P) D4.5(C1)
Net-(D4-11): D4.11(-V) D12.6(2)
Net-(D4-12): D4.12(-P) D8.3(С) D15.9(2)
Net-(D5-11): D5.11(-V) D6.11(-V) D9.5(Q) D9.11(C)
Net-(D5-12): D5.12(-P) D6.5(C1)
Net-(D7.1-1): D7.1(C) D9.8(-Q) D9.12(D) D14.4(3)
Net-(D7.1-6): D7.6(Q3) D7.10(CE)
Net-(D8.1-2): D8.2(D) D8.6(&#126;Q) D15.8(1) D16.13(I3)
Net-(D8.2-12): D8.12(D) D16.8(O)
Net-(D9.1-2): D9.2(D) D13.6(3)
Net-(D10.1-3): D10.3(2) D12.12(2)
Net-(D10.2-4): D10.4(3) D16.5(I3)
Net-(D10.3-10): D10.10(3) D18.13(1)
Net-(D10.4-12): D10.12(2) D12.13(1) D14.8(5)
Net-(D11.1-2): D11.2 D17.6(3)
Net-(D11.1-3): D11.3 D11.4(1)
Net-(D11.2-6): D11.6(3) D18.5(1)
Net-(D12.3-5): D12.5(1) D15.10(3)
Net-(D12.4-8): D12.8(2) D16.2(I2)
Net-(D13.1-1): D13.1 D15.1(3)
Net-(D13.3-9): D13.9(1) D15.4(3)
Net-(D13.4-12): D13.12(1) D15.13(3) D16.4(I2)
Net-(D17.2-5): D17.5(2) D39.10(4)
Net-(D18.1-2): D18.2 D28.20(-CE)
Net-(D18.3-6): D18.6(2) D43.1(SE)
Net-(D18.4-8): D18.8(2) D24.15(-E2)
Net-(D18.4-9): D18.9(1) D18.10(2) D25.15(-E2)
Net-(D37-2): D37.2(Q1) R301.2 R304.2
Net-(D37-5): D37.5(Q2) R302.2 R305.2
Net-(D37-7): D37.7(Q3) R16.1
Net-(D37-10): D37.10(Q4) R303.2 R306.2
Net-(D37-15): D37.15(Q6) R18.1
Net-(D38-10): D38.10(4) D43.3(B0)
Net-(D38-11): D38.11(3) D43.11(A2)
Net-(D38-12): D38.12(2) D43.14(A3)
Net-(D38-13): D38.13(1) D43.2(A0)
Net-(D39-11): D39.11(3) D43.5(A1) D43.6(B1)
Net-(D39-12): D39.12(2) D43.10(B2)
Net-(D39-13): D39.13(1) D43.13(B3)
Net-(D40-10): D40.10(4) D41.1(D0)
Net-(D41-10): D41.10(4) D42.1(D0)
Net-(D43-4): D43.4(Y0) R27.2
Net-(D43-7): D43.7(Y1) VD14.1(A) VD15.2(K) VD16.2(K) VD17.2(K)
Net-(D43-9): D43.9(Y2) R28.2
Net-(D43-12): D43.12(Y3) R29.2
Net-(D45.1-2): D45.2(D) D45.6(&#126;Q)
Net-(DA3-3): DA3.3(Вых) R104.2
Net-(H1-2): H1.2 R4.2
Net-(H2-2): H2.2 R37.2
Net-(J1-1): J1.1 R20.2 R21.1 VD13.1(A)
Net-(J1-2): J1.2 R24.1 R25.1 R26.1
Net-(R30-2): R30.2 VD15.1(A)
Net-(R31-2): R31.2 VD16.1(A)
Net-(R32-2): R32.2 VD17.1(A)
Net-(R33-1): R33.1 VT1.3(E) VT2.3(E)
Net-(R34-1): R34.1 VT3.3(E) VT4.3(E)
Net-(R35-1): R35.1 VT5.3(E) VT6.3(E)
Net-(R36-1): R36.1 VT7.3(E) VT8.3(E)
Net-(S1-2): S1.2 X5.1(+12)
Net-(S4-2): S4.2 X5.4(+5)
Net-(VD5-1): VD5.1(A) X8.1
Net-(VD6-1): VD6.1(A) X8.2
Net-(VD7-1): VD7.1(A) X8.3
Net-(VD8-1): VD8.1(A) X8.4
Net-(VD9-1): VD9.1(A) X8.5
Net-(VD10-1): VD10.1(A) X8.6
Net-(VD11-1): VD11.1(A) X8.7
Net-(VD12-1): VD12.1(A) X8.8

Not connected (* = marked no-connect by the designer): D1 7(GND) 14(VCC); D2 6(&#126;Q)* 7(GND) 8(-Q)* 14(VCC); D3 8(GND) 13(-B)* 16(VCC); D4 8(GND) 13(-B)* 16(VCC); D5 8(GND) 13(-B)* 16(VCC); D6 8(GND) 12(-P)* 13(-B)* 16(VCC); D7 3(Q0)* 4(Q1)* 5(Q2)* 8(GND) 12(Q1)* 13(Q2)* 14(Q3)* 16(VCC); D8 7(GND) 8(-Q)* 14(VCC); D9 6(&#126;Q)* 7(GND) 14(VCC); D10 7(GND) 14(VCC); D11 7(GND) 14(VCC); D12 7(GND) 14(VCC); D13 7(GND) 14(VCC); D14 7(GND) 14(VCC); D15 7(GND) 14(VCC); D16 7(GND) 14(VCC); D17 7(GND) 14(VCC); D18 7(GND) 14(VCC); D19 8(GND) 16(VCC); D20 8(GND) 16(VCC); D21 8(GND) 16(VCC); D22 8(GND) 16(VCC); D23 8(GND) 16(VCC); D24 8(GND) 16(VCC); D25 8(GND) 16(VCC); D26 11(VCC) 29(GND); D27 14(GND) 28(VCC); D28 14(GND) 28(VCC); D29 8(VCC) 16(GND); D30 8(VCC) 16(GND); D31 8(VCC) 16(GND); D32 8(VCC) 16(GND); D33 8(VCC) 16(GND); D34 8(VCC) 16(GND); D35 8(VCC) 16(GND); D36 8(VCC) 16(GND); D37 8(GND) 12(Q5)* 16(VCC); D38 7(GND) 14(VCC); D39 7(GND) 14(VCC); D40 7(GND) 11(3)* 12(2)* 13(1)* 14(VCC); D41 7(GND) 11(3)* 12(2)* 13(1)* 14(VCC); D42 7(GND) 11(3)* 12(2)* 13(1)* 14(VCC); D43 8(GND) 16(VCC); D44 12(GND) 23(INR)* 24(VCC); D45 7(GND) 8(-Q)* 9(Q)* 14(VCC); DA3 7(P)*; X1 A2(2)* A4(4)* A9(9)* A10(10)* A11(11)* A12(12)* A13(13)* B2(2)* B9(9)* B11(11)* B12(12)* B13(13)* B19(19)* B21(21)*

## Notes on the sheets
sheet 1
- "Video"
- VID4
- "Joystick"
- Fire2
- →
- ←
- ↓
- ↑
- Fire1
- Опциональный
- При питании от 5В, вместо DA1 установить перемычку
sheet 2
- Динамическая память 64к х 8бит
